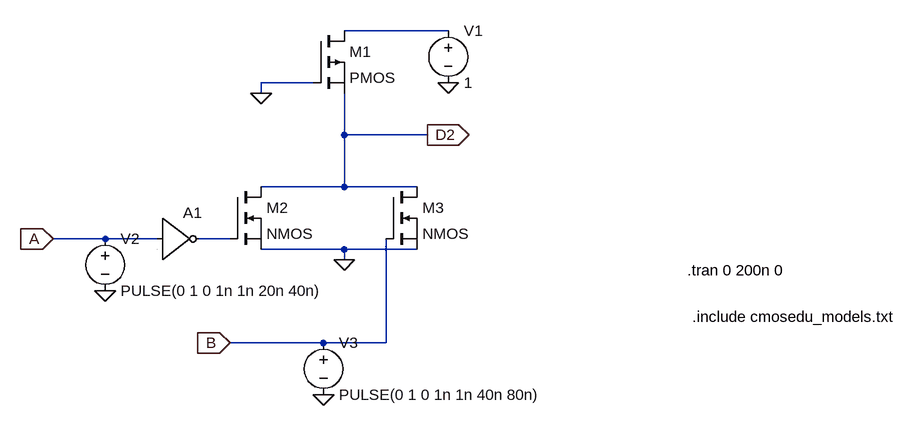
[diagram p0: schematic EXP 8 D2.asc]
EXP 8 D2.asc, the LTspice schematic file:
Version 4
SHEET 1 988 680
WIRE 272 -32 112 -32
WIRE 64 48 -16 48
WIRE -16 64 -16 48
WIRE 112 128 112 64
WIRE 240 128 112 128
WIRE 112 208 112 128
WIRE 112 208 -16 208
WIRE 224 208 112 208
WIRE -256 288 -336 288
WIRE -176 288 -256 288
WIRE -64 288 -112 288
WIRE 112 304 -16 304
WIRE 224 304 112 304
WIRE 112 320 112 304
WIRE 80 448 -64 448
WIRE 176 448 176 288
WIRE 176 448 80 448
FLAG 240 128 D2
IOPIN 240 128 Out
FLAG -16 64 0
FLAG 112 320 0
FLAG -336 288 A
IOPIN -336 288 In
FLAG -64 448 B
IOPIN -64 448 In
FLAG 272 48 0
FLAG -256 368 0
FLAG 80 528 0
SYMBOL pmos 64 -32 R0
SYMATTR InstName M1
SYMBOL nmos -64 208 R0
SYMATTR InstName M2
SYMBOL nmos 176 208 R0
SYMATTR InstName M3
SYMBOL voltage 272 -48 R0
WINDOW 123 0 0 Left 0
WINDOW 39 0 0 Left 0
SYMATTR InstName V1
SYMATTR Value 1
SYMBOL voltage -256 272 R0
WINDOW 123 0 0 Left 0
WINDOW 39 0 0 Left 0
SYMATTR InstName V2
SYMATTR Value PULSE(0 1 0 1n 1n 20n 40n)
SYMBOL voltage 80 432 R0
WINDOW 123 0 0 Left 0
WINDOW 39 0 0 Left 0
SYMATTR InstName V3
SYMATTR Value PULSE(0 1 0 1n 1n 40n 80n)
SYMBOL Digital\\inv -176 224 R0
SYMATTR InstName A1
TEXT 640 336 Left 2 !.tran 0 200n 0
TEXT 648 408 Left 2 !.include cmosedu_models.txt

The netlist it stands for:
* EXP 8 D2.asc
M1 N001 0 D2 D2 PMOS
M2 D2 N002 0 0 NMOS
M3 D2 B 0 0 NMOS
V1 N001 0 1
V2 A 0 PULSE(0 1 0 1n 1n 20n 40n)
V3 B 0 PULSE(0 1 0 1n 1n 40n 80n)
A1 A 0 0 0 0 N002 0 0 BUF
.model NMOS NMOS
.model PMOS PMOS
.lib standard.mos
.tran 0 200n 0
.include cmosedu_models.txt
.backanno
.end